# EAGLE design Adafruit MPM3610 (EAGLE 9.6.2)
COMPANY: ADAFRUIT INDUSTRIES; DRAWN: KTOWN; REV: A
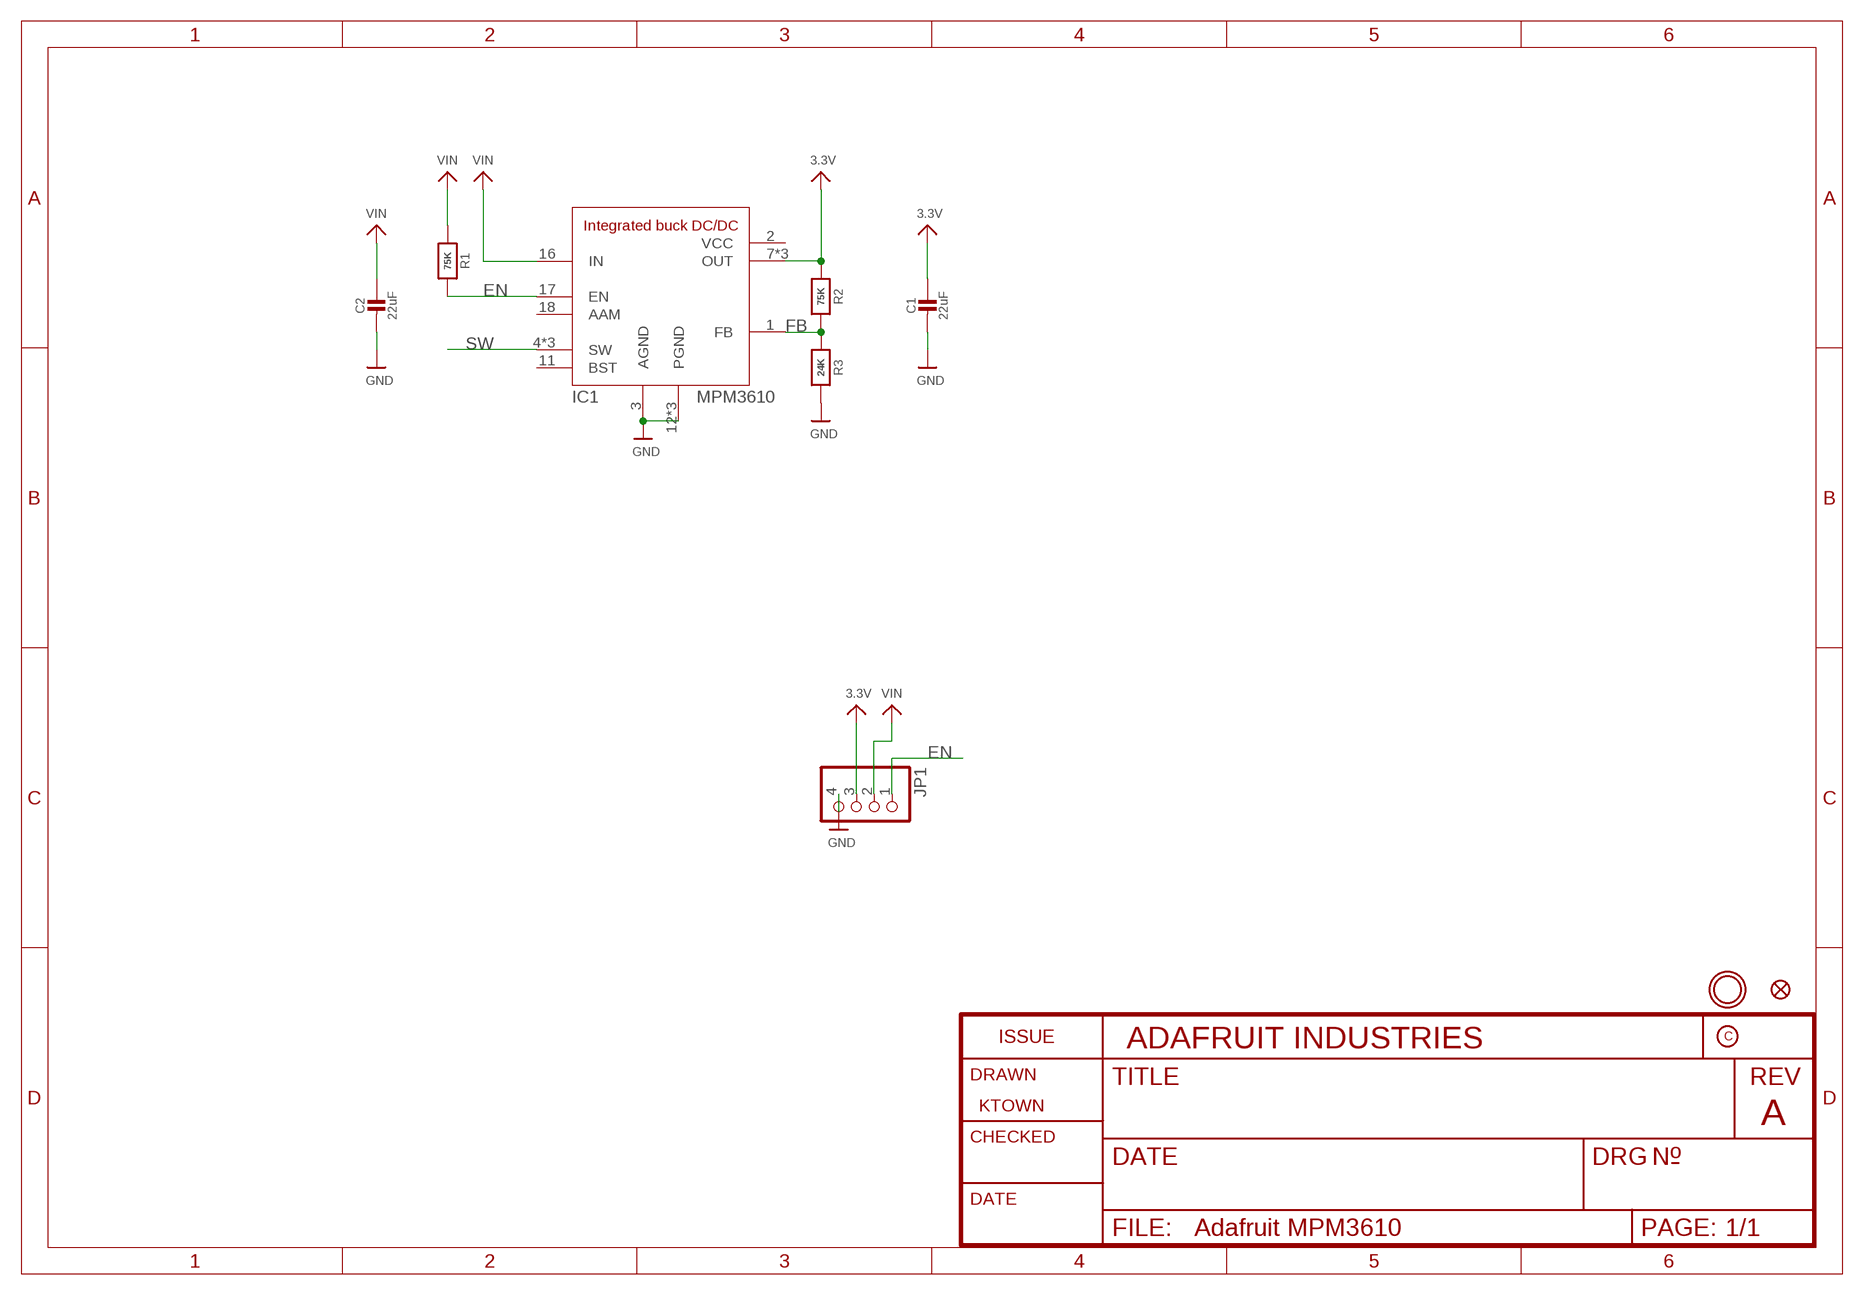
[diagram p0: schematic, sheet 1]

## Parts
C1  22uF  CAP_CERAMIC0805-NOOUTLINE  [0805-NO]
C2  22uF  CAP_CERAMIC0805-NOOUTLINE  [0805-NO]
FID1  FIDUCIAL_1MM  [FIDUCIAL_1MM]
IC1  MPM3610  [MPM3610]
JP1  HEADER-1X4ROUND  [1X04_ROUND]
R1  75K  RESISTOR_0603_NOOUT  [0603-NO]
R2  75K  RESISTOR_0603_NOOUT  [0603-NO]
R3  24K  RESISTOR_0603_NOOUT  [0603-NO]
U$9  MOUNTINGHOLE2.5  [MOUNTINGHOLE_2.5_PLATED]

## Nets
3.3V: C1.1 IC1.7(OUT) IC1.8(OUT) IC1.9(OUT) JP1.3 R2.1
EN: IC1.17(EN) JP1.1 R1.2
FB: IC1.1(FB) R2.2 R3.1
GND: C1.2 C2.2 IC1.3(AGND) IC1.12(PGND) IC1.13(PGND) IC1.14(PGND) JP1.4 R3.2
SW: IC1.4(SW) IC1.5(SW) IC1.6(SW)
VIN: C2.1 IC1.16(IN) JP1.2 R1.1
Unconnected: IC1.11(BST) IC1.18(AAM)

## Power pins joined to a net without a drawn wire
VCC: IC1.2(VCC)

## Library data of the parts
C1 C2 = microbuilder:CAP_CERAMIC: Ceramic Capacitors For new designs, use the packages preceded by an '_' character since they are more reliable: The following footprints should be used on most boards: _0402 - Standard footprint for regular board layouts _0603 - Standard footprint for regular board layouts _0805 - Standard footprint for regular board layouts _1206 - Standard footprint for regular board layouts For extremely tight-pitch boards where space is at a premium, the following 'micro-pitch' footprints can be used (smaller pads, no silkscreen outline, etc.): _0402MP - Micro-pitch footprint for very dense/compact boards _0603MP - Micro-pitch footprint for very dense/compact boards _0805MP - Micro-pitch footprint for very dense/compact boards _1206MP - Micro-pitch footprint for very dense/compact boards
FID1 = microbuilder:FIDUCIAL: Fiducial Alignment Points Various fiducial points for machine vision alignment.; BOM: EXCLUDE
IC1 = microbuilder:MPM3610
JP1 = microbuilder:HEADER-1X4: PIN HEADER
R1-R3 = microbuilder:RESISTOR: Resistors For new designs, use the packages preceded by an '_' character since they are more reliable: The following footprints should be used on most boards: _0402 - Standard footprint for regular board layouts _0603 - Standard footprint for regular board layouts _0805 - Standard footprint for regular board layouts _1206 - Standard footprint for regular board layouts For extremely tight-pitch boards where space is at a premium, the following 'micro-pitch' footprints can be used (smaller pads, no silkscreen outline, etc.): _0402MP - Micro-pitch footprint for very dense/compact boards _0603MP - Micro-pitch footprint for very dense/compact boards _0805MP - Micro-pitch footprint for very dense/compact boards _1206MP - Micro-pitch footprint for very dense/compact boards
U$9 = microbuilder:MOUNTINGHOLE: Mounting Hole For #2 screws (0.086"/2.18mm width, 0.094"/2.4mm hole) use 2.5mm; BOM: EXCLUDE

## Board
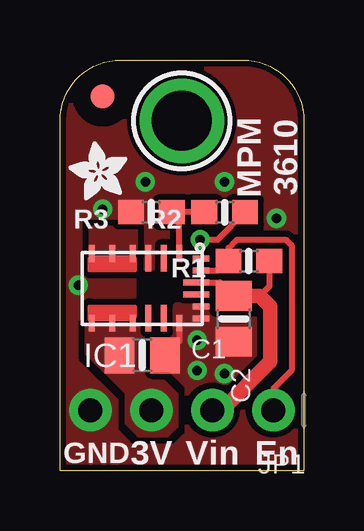
[diagram p1: board, top side]
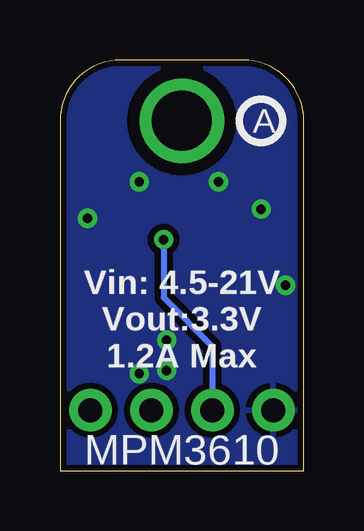
[diagram p2: board, bottom side, seen from below]

Size 10.16 x 17.14 mm. Coordinates in mm from the lower left corner, seen from the top.
Outline: 0,0 0,14.61 arc-90 2.54,17.14 7.62,17.14 arc-90 10.16,14.61 10.16,0 0,0
Copper layers (1*16): Top 0.035mm / dielectric 1.5mm / Bottom 0.035mm
Design rules "adafruit *": minimum track width 8mil, minimum drill 15.5mil, track to track 8mil, track to pad 8mil, pad to pad 8mil, via to via 8mil, smd to smd 8mil, copper to edge 10mil, drill to drill 8mil, minimum pad ring 10mil, minimum via ring 8mil, stop-mask expansion 2mil, vias tented up to drill 20mil, thermal gap 10mil

### Footprints (pad centres in the part's own frame; a part is rotated, then mirrored left to right if it is on the bottom)
0805-NO = smd 1.24 x 1.5: 1 -0.95,0; 2 0.95,0
FIDUCIAL_1MM = smd 1 x 1: 1 0,0
MPM3610 = smd 0.7 x 0.25: 1 -1.45,1.55; 4 -1.45,-0.4; 5 -1.45,-1.25; 6 -1.45,-2.1; 7 1.45,-2.1; 8 1.45,-1.25; 9 1.45,-0.4; 12 1.45,1.55 | smd 1.1 x 0.25: 2 -1.25,0.9; 3 -1.25,0.25; 10 1.25,0.25; 11 1.25,0.9 | smd 0.25 x 0.7: 13 1.25,2.45; 14 0.75,2.45; 17 -0.75,2.45; 18 -1.25,2.45 | smd 0.25 x 1.1: 15 0.25,2.25; 16 -0.25,2.25
1X04_ROUND = drill 1 pad 1.778: 1 -3.81,0; 2 -1.27,0; 3 1.27,0; 4 3.81,0
0603-NO = smd 1.075 x 1: 1 -0.85,0; 2 0.85,0
MOUNTINGHOLE_2.5_PLATED = drill 2.5 pad 3.2: P$1 0,0

### Placement (x,y rotation side)
C1  3.43,4.83 0 top
C2  7.24,6.35 270 top
FID1  1.78,15.62 0 top
IC1  3.43,7.62 270 top
JP1  5.08,2.54 180 top
R1  7.87,8.76 180 top
R2  6.86,10.79 180 top
R3  3.81,10.79 180 top
U$9  5.08,14.61 0 top
U$10  [PCBFEAT-REV-040]  1.78,14.61 0 bottom
U$11  [ADAFRUIT_2.5MM]  2.79,11.3 90 top

### Tracks (layer width: path | path; a pad name or v marks a point on that pad's centre or on a via)
3.3V  (via drill 0.39)
  Top 0.254: R2.1 6.57,9.65 v5.84,9.65
  Bottom 0.254: v5.84,9.65 5.84,7.24 3.81,5.21 JP1.3
  pour Top (no thermals): 1.14,7.24 1.14,4.95 2.79,3.3 2.79,2.03 3.3,1.52 4.45,1.52 4.83,1.91 4.83,3.17 4.32,3.68 3.81,3.68 3.43,4.06 3.43,7.24
EN
  Top 0.254: IC1.17 6.63,8.37 R1.2 7.02,9.31 7.37,9.65 9.4,9.65 9.65,9.4 9.65,4.19 8.89,3.43 JP1.1
FB
  Top 0.254: IC1.1 4.98,10.48 R3.1 R2.2
GND  (via drill 0.39)
  Top 0.254: IC1.12 4.98,5.43 C1.2
  other vias: 6.86,4.06 6.86,12.06 9.02,10.54 5.71,4.19 5.71,5.46 1.78,10.92 3.56,12.06 0.76,7.75
  pour Top (isolate 0.254, rank 6, no thermals): 0,0 0,17.14 10.16,17.14 10.16,0
  pour Bottom (isolate 0.254, rank 5): 0,0 0,17.14 10.16,17.14 10.16,0
SW
  pour Top (rank 2, no thermals): 1.27,8.38 1.27,10.16 3.05,10.16 3.17,10.16 3.17,8.38
VIN
  Top 0.254: IC1.16 6.67,7.87 C2.1 | R1.1 8.72,7.7 8.32,7.3
  Top 0.61: C2.1 8.32,7.3 8.76,6.86 8.76,4.57 6.73,2.54 JP1.2

### Text on the board
tPlace: MPM / 3610 | GND | 3V | Vin | En
bPlace: Vin: 4.5-21V / Vout:3.3V / 1.2A Max | MPM3610